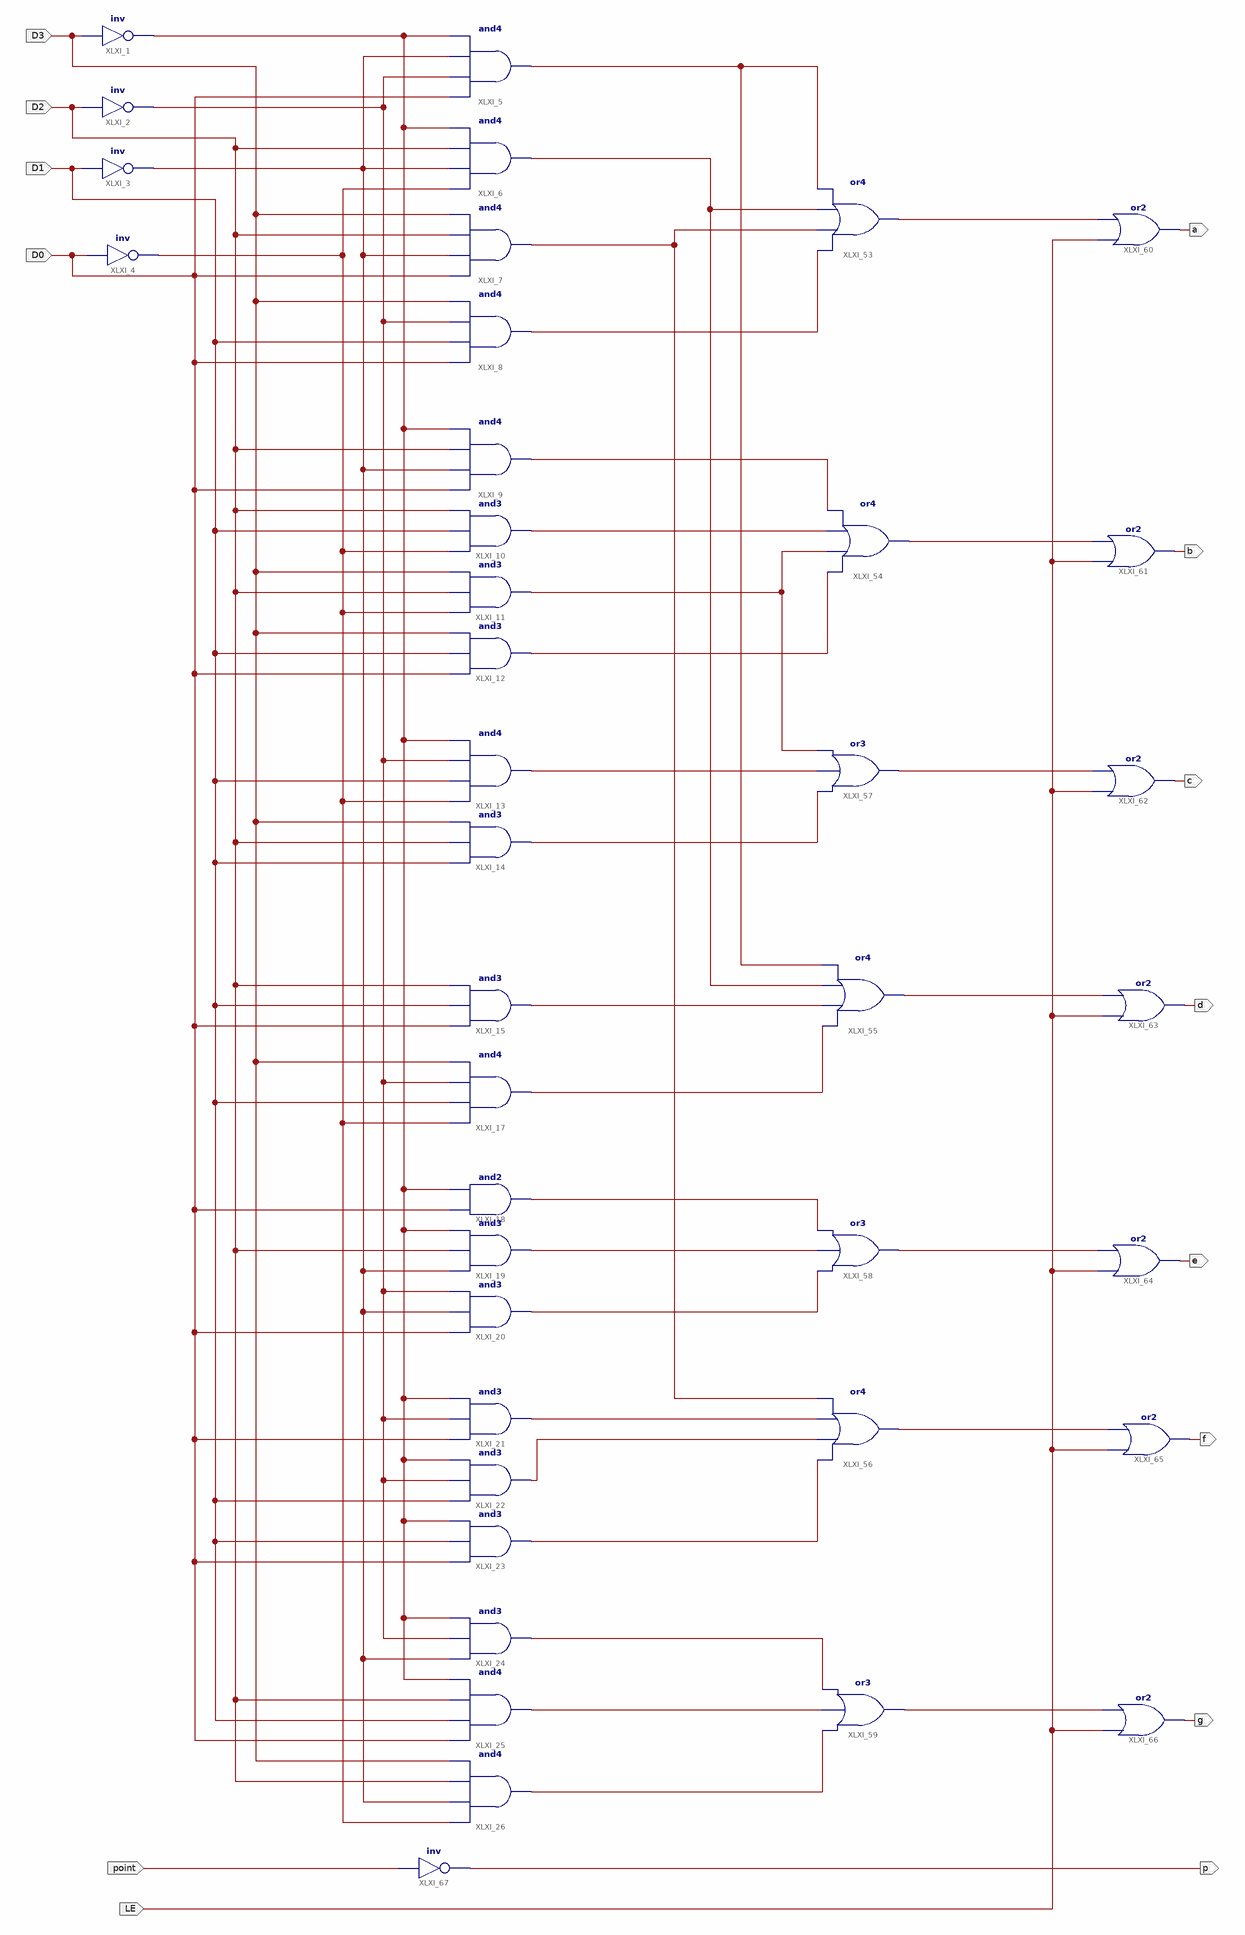
[diagram p0: schematic sheet 1]
// Xilinx ISE schematic MC14495_ZJU.sch (kintex7) as structural Verilog: 40 symbols, 14 ports
module MC14495_ZJU (
  input  D2,
  input  D1,
  input  D0,
  input  D3,
  input  LE,
  input  point,
  output p,
  output a,
  output b,
  output c,
  output d,
  output e,
  output f,
  output g
);

  wire XLXN_3, XLXN_4, XLXN_7, XLXN_8, XLXN_35, XLXN_36, XLXN_37, XLXN_38, XLXN_41, XLXN_42, XLXN_43,
       XLXN_46, XLXN_48, XLXN_49, XLXN_52, XLXN_53, XLXN_57, XLXN_58, XLXN_59, XLXN_62, XLXN_63, XLXN_64,
       XLXN_68, XLXN_69, XLXN_70, XLXN_71, XLXN_76, XLXN_77, XLXN_78, XLXN_79, XLXN_81, XLXN_82;

  not XLXI_1 (XLXN_4, D3);
  not XLXI_2 (XLXN_3, D2);
  not XLXI_3 (XLXN_8, D1);
  not XLXI_4 (XLXN_7, D0);
  and XLXI_5 (XLXN_38, D0, XLXN_3, XLXN_8, XLXN_4);
  and XLXI_6 (XLXN_35, XLXN_7, XLXN_8, D2, XLXN_4);
  and XLXI_7 (XLXN_36, D0, XLXN_8, D2, D3);
  and XLXI_8 (XLXN_37, D0, D1, XLXN_3, D3);
  and XLXI_9 (XLXN_41, D0, XLXN_8, D2, XLXN_4);
  and XLXI_10 (XLXN_42, XLXN_7, D1, D2);
  and XLXI_11 (XLXN_43, XLXN_7, D2, D3);
  and XLXI_12 (XLXN_46, D0, D1, D3);
  and XLXI_13 (XLXN_48, XLXN_7, D1, XLXN_3, XLXN_4);
  and XLXI_14 (XLXN_49, D1, D2, D3);
  and XLXI_15 (XLXN_52, D0, D1, D2);
  and XLXI_17 (XLXN_53, XLXN_7, D1, XLXN_3, D3);
  and XLXI_18 (XLXN_57, D0, XLXN_4);
  and XLXI_22 (XLXN_63, D1, XLXN_3, XLXN_4);
  and XLXI_23 (XLXN_64, D0, D1, XLXN_4);
  and XLXI_21 (XLXN_62, D0, XLXN_3, XLXN_4);
  and XLXI_19 (XLXN_58, XLXN_8, D2, XLXN_4);
  and XLXI_20 (XLXN_59, D0, XLXN_8, XLXN_3);
  and XLXI_24 (XLXN_68, XLXN_8, XLXN_3, XLXN_4);
  and XLXI_25 (XLXN_69, D0, D1, D2, XLXN_4);
  and XLXI_26 (XLXN_70, XLXN_7, XLXN_8, D2, D3);
  or XLXI_53 (XLXN_71, XLXN_37, XLXN_36, XLXN_35, XLXN_38);
  or XLXI_54 (XLXN_82, XLXN_46, XLXN_43, XLXN_42, XLXN_41);
  or XLXI_55 (XLXN_79, XLXN_53, XLXN_52, XLXN_35, XLXN_38);
  or XLXI_56 (XLXN_77, XLXN_64, XLXN_63, XLXN_62, XLXN_36);
  or XLXI_57 (XLXN_81, XLXN_49, XLXN_48, XLXN_43);
  or XLXI_58 (XLXN_78, XLXN_59, XLXN_58, XLXN_57);
  or XLXI_59 (XLXN_76, XLXN_70, XLXN_69, XLXN_68);
  or XLXI_60 (a, LE, XLXN_71);
  or XLXI_61 (b, LE, XLXN_82);
  or XLXI_62 (c, LE, XLXN_81);
  or XLXI_63 (d, LE, XLXN_79);
  or XLXI_64 (e, LE, XLXN_78);
  or XLXI_65 (f, LE, XLXN_77);
  or XLXI_66 (g, LE, XLXN_76);
  not XLXI_67 (p, point);
endmodule
